# EAGLE design slush_cap_board_rev_a (EAGLE 8.5.0)
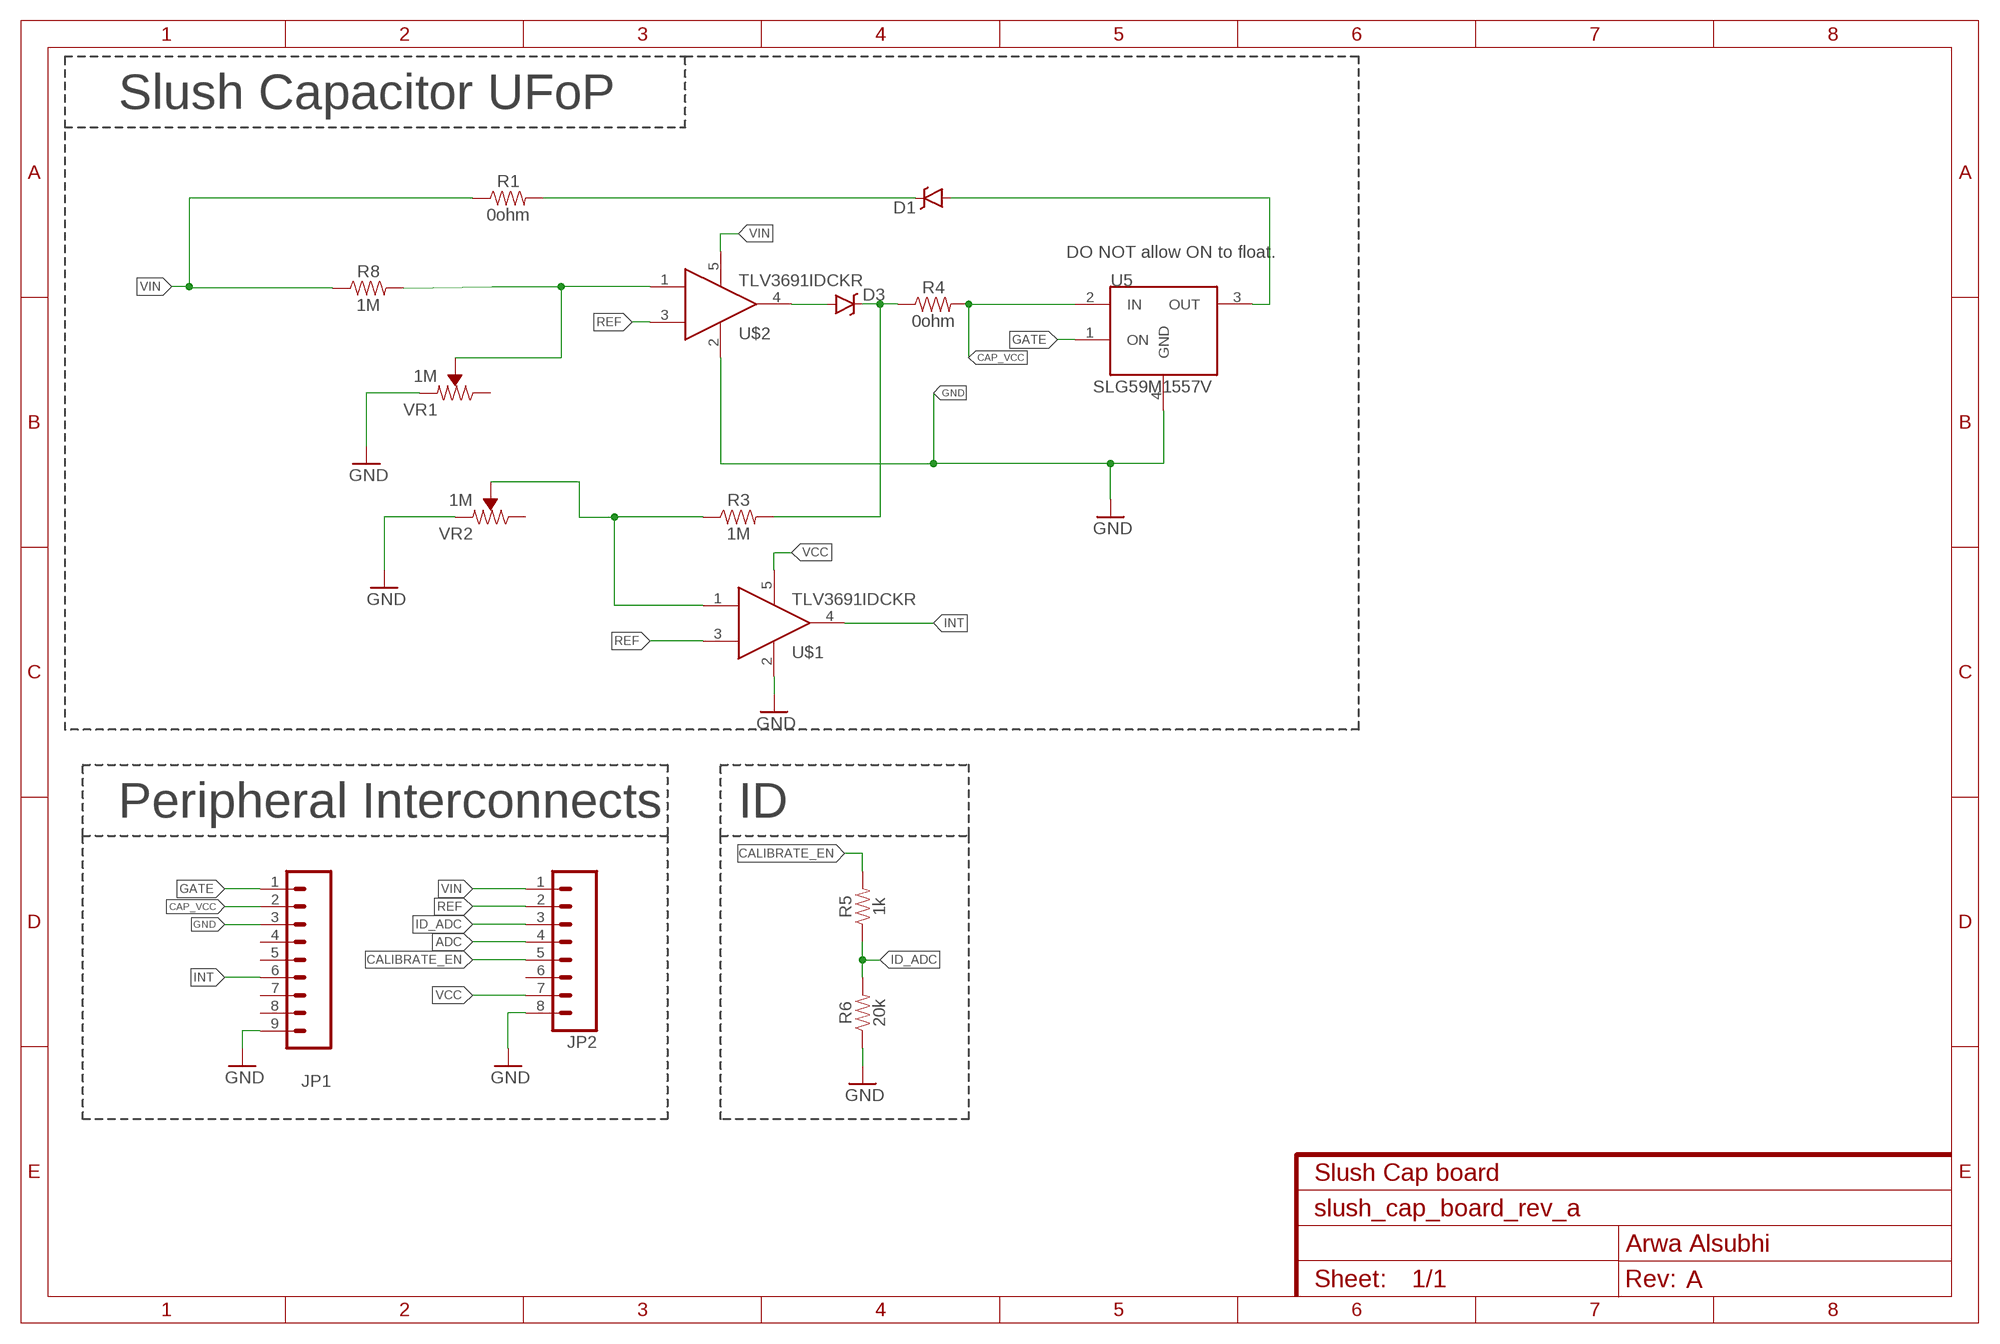
[diagram p0: schematic, sheet 1]
FRAME2 (FRAME-A4L): CNAME: Slush Cap board; CREVISION: A; DESIGNER: Arwa Alsubhi

## Parts
D1  RB751  DIODE-SCHOTTKY-RB751  [SOD-523]
D3  RB751  DIODE-SCHOTTKY-RB751  [SOD-523]
JP1  M091.27MM  [1X09-1.27MM]
JP2  M081.27MM  [1X08-1.27MM]
R1  0ohm  0603-RESISTOR-0603-1/10W-1%  [0603]
R3  1M  0.3OHM-0805-1/8W-1%  [0805]
R4  0ohm  0603-RESISTOR-0603-1/10W-1%  [0603]
R5  1k  0603-RESISTOR-0603-1/10W-1%  [0603]
R6  20k  0603-RESISTOR-0603-1/10W-1%  [0603]
R8  1M  0.3OHM-0805-1/8W-1%  [0805]
U5  SLG59M1557V  [4STDFN]
U$1  TLV3691IDCKR  [SOT353]
U$2  TLV3691IDCKR  [SOT353]
VR1  1M  TRIMPOT-SMD-3MM-CLOSED-1/8W-20%  [TRIMPOT-SMD-3MM-CLOSED]
VR2  1M  TRIMPOT-SMD-3MM-CLOSED-1/8W-20%  [TRIMPOT-SMD-3MM-CLOSED]

## Nets
ADC: JP2.4
CALIBRATE_EN: JP2.5 R5.2
CAP_VCC: JP1.2 R4.2 U5.2(IN)
GATE: JP1.1 U5.1(ON)
GND: JP1.3 JP1.9 JP2.8 R6.1 U5.4(GND) U$1.2 U$2.2 VR1.1(CCW) VR2.1(CCW)
ID_ADC: JP2.3 R5.1 R6.2
INT: JP1.6 U$1.4
N$1: D3.A U$2.4
N$2: D3.C R3.2 R4.1
N$3: D1.A U5.3(OUT)
N$4: R8.2 U$2.1 VR1.2(WIPER)
N$5: R3.1 U$1.1 VR2.2(WIPER)
N$6: D1.C R1.2
REF: JP2.2 U$1.3 U$2.3
VCC: JP2.7 U$1.5
VIN: JP2.1 R1.1 R8.1 U$2.5
Unconnected: JP1.4 JP1.5 JP1.7 JP1.8 JP2.6 VR1.3(CW) VR2.3(CW)

## Notes on the sheet
- Slush Capacitor UFoP
- DO NOT allow ON to float.
- Peripheral Interconnects | ID

## Library data of the parts
D1 D3 = SparkFun-DiscreteSemi:DIODE-SCHOTTKY: Schottky diodes in SFE's production catalog BAT20J 1A 23V 0.62Vf RB751 120mA 40V 0.37Vf PMEG4005EJ 0.5A 40V 0.42Vf MBRA140 1A 40V 0.5Vf B340A 3A 40V SMA; DIGIKEY: BAS40-02V-V-G-08GICT-ND; MPN: BAS40-02V-V-G-08; PROD_ID: DIO-11018
JP1 = SparkFun-Connectors:M09: Header 9 Standard 9-pin 0.1" header. Use with straight break away headers (SKU : PRT-00116), right angle break away headers (PRT-00553), swiss pins (PRT-00743), machine pins (PRT-00117), and female headers (PRT-00115).; DIGIKEY: S9014E-09-ND; MANUFACTURERPARTNUMBER: GRPB091VWVN-RC; MPN: GRPB091VWVN-RC
JP2 = SparkFun-Connectors:M08: Header 8 Standard 8-pin 0.1" header. Use with straight break away headers (SKU : PRT-00116), right angle break away headers (PRT-00553), swiss pins (PRT-00743), machine pins (PRT-00117), and female headers (PRT-00115).; DIGIKEY: S9014E-08-ND; MANUFACTURERPARTNUMBER: GRPB081VWVN-RC; MPN: GRPB081VWVN-RC
R1 R4-R6 = Arwa_lib:0603-RESISTOR: resistor A resistor is a passive two-terminal electrical component that implements electrical resistance as a circuit element. Resistors act to reduce current flow, and, at the same time, act to lower voltage levels within circuits. - Wikipedia; PROD_ID: RES-08787
R3 R8 = SparkFun-Resistors:0.3OHM: 0.3Ω resistor A resistor is a passive two-terminal electrical component that implements electrical resistance as a circuit element. Resistors act to reduce current flow, and, at the same time, act to lower voltage levels within circuits. - Wikipedia; PROD_ID: RES-11622; VALUE: 0.3
U5 = loadswitches:SLG59M1557V: SILEGO SLG59M1557V: Ultra-small 28.5 mΩ, 1.0 A Integrated Power Switch with Discharge The SLG59M1557V is designed for load switching applications with ultra low quiescent current (20nA), and low turn on voltage (0.85V). The part comes with one 28.5 mΩ 1.0 A rated P-channel MOSFET controlled by a single ON control pin. The product is packaged in an ultra-small 1.0 x 1.0 mm package.; MANAFACTURER: SLG59M1557V; MOUSER: 402-SLG59M1557V; MPN: SLG59M1557V
U$1 U$2 = Arwa_lib:TLV3691IDCKR
VR1 VR2 = SparkFun-Resistors:TRIMPOT: Trimming Potentiometer (Trimpot) Three-terminal potentiometers, with an adjustable wiper and two adjustable resistors. A pot can be used to create a configurable voltage divider, or as a variable resistor. "Trimpots" are a subset of potentiometers, usually intended for "set-and-forget" applications. They're often more delicate than standard potentiometers - rated for fewer turns. Variants PTH-KNOB - PTH Trimpot w/ finger-adjustable knob Trimpot 10K with Knob <https://www.sparkfun.com/products/9806> (COM-09806) Datasheet <http://www.sparkfun.com/datasheets/Components/General/TSR-3386.pdf> SMD-3MM-CLOSED-FRAME - SMD 3mm Square Closed-Frame Trimpot Used on e.g. EasyDriver - Stepper Motor Driver <https://www.sparkfun.com/products/12779> Datasheet <http://www.bitechnologies.com/pdfs/22.pdf> (22AR10KTR) SMD-5MM - SMD 5mm Square Closed-Frame Trimpot Used on e.g. IOIO-OTG - V2.2 <https://www.sparkfun.com/products/13613> Datasheet <http://www.vishay.com/docs/51008/ts53.pdf> (TS53YL502MR10) SMD-3MM-1/10W-25% - 3mm Square Open-Frame Trimpot Used on e.g. SparkFun Shapeoko <https://www.sparkfun.com/products/13899> Datasheet <http://www.bourns.com/docs/Product-Datasheets/TC33.pdf> (TC33X-2-103E); PROD_ID: RES-09285; VALUE: 10k

## Board
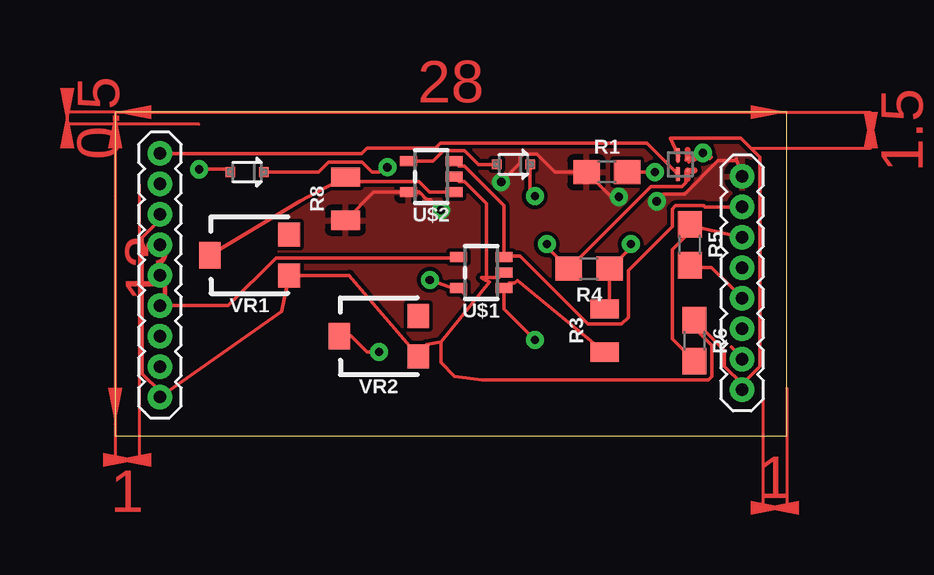
[diagram p1: board, top side]
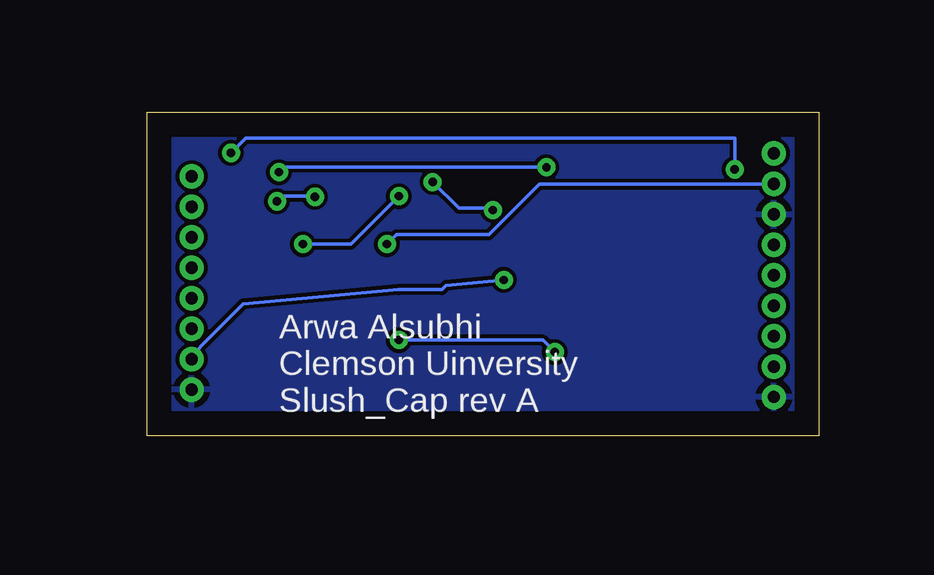
[diagram p2: board, bottom side, seen from below]

Size 28 x 13.5 mm. Coordinates in mm from the lower left corner, seen from the top.
Outline: 0,0 28,0 28,13.5 0,13.5 0,0
Copper layers (1*16): Top 0.035mm / dielectric 1.5mm / Bottom 0.035mm
Design rules "default": minimum track width 6mil, minimum drill 0.35mm, track to track 6mil, track to pad 6mil, pad to pad 6mil, via to via 6mil, smd to smd 6mil, copper to edge 40mil, drill to drill 6mil, minimum pad ring 10mil, minimum via ring 8mil, stop-mask expansion 4mil, vias tented up to drill 0mil, thermal gap 10mil

### Footprints (pad centres in the part's own frame; a part is rotated, then mirrored left to right if it is on the bottom)
SOD-523 = smd 0.4 x 0.4: A -0.7,0; C 0.7,0
1X09-1.27MM = drill 0.508 pad 1: 1 0,0; 2 1.27,0; 3 2.54,0; 4 3.81,0; 5 5.08,0; 6 6.35,0; 7 7.62,0; 8 8.89,0; 9 10.16,0
1X08-1.27MM = drill 0.508 pad 1: 1 0,0; 2 1.27,0; 3 2.54,0; 4 3.81,0; 5 5.08,0; 6 6.35,0; 7 7.62,0; 8 8.89,0
0603 = smd 1.1 x 1: 1 -0.85,0; 2 0.85,0
0805 = smd 0.8 x 1.2: 1 -0.9,0; 2 0.9,0
4STDFN = smd 0.6 x 0.2: 1 -0.4,0.1; 4 0.4,0.1 | smd 0.152 x 0.152: 2 -0.25,-0.3; 3 0.25,-0.3
SOT353 = smd 0.42 x 0.7: 1 -0.65,-0.95; 2 0,-0.95; 3 0.65,-0.95; 4 0.65,0.95; 5 -0.65,0.95
TRIMPOT-SMD-3MM-CLOSED = smd 1 x 0.9: 1 -0.85,-1.65; 3 0.85,-1.65 | smd 1.1 x 0.9: 2 0,1.65

### Placement (x,y rotation side)
D1  5.5,11 0 top
D3  16.6,11.32 0 top
JP1  1.87,11.78 270 top
JP2  26.14,10.82 270 top
R1  20.5,11 0 top
R3  20.41,4.39 90 top
R4  19.76,6.97 180 top
R5  23.95,7.97 270 top
R6  24.14,3.97 270 top
R8  9.6,9.89 90 top
U5  23.56,11.32 90 top
U$1  15.26,6.81 90 top
U$2  13.18,10.81 90 top
VR1  5.6,7.54 90 top
VR2  10.99,4.16 90 top

### Tracks (layer width: path | path; a pad name or v marks a point on that pad's centre or on a via)
CALIBRATE_EN
  Top 0.152: R5.2 23.99,7.03 24.86,7.03 25.62,6.26 JP2.5
CAP_VCC  (via drill 0.35)
  Top 0.152: U5.2 23.79,11 23.79,10.56 23.62,10.39 22.33,10.39 R4.2 18,7.88 v18,8
  Bottom 0.152: v18,8 17.61,8.39 13.75,8.39 11.63,10.51 JP1.2
GATE
  Top 0.152: 23.38,10.99 U5.1 22.18,12.2 13.56,12.2 13.36,12 10.5,12 10.28,11.78 JP1.1
GND
  Top 0.152: U$1.2 16,6.6 15.27,6.6 15.49,6.48 | 13.58,3.92 12.98,3.81 VR2.1 9.76,6.69 VR1.1 6.94,5.19 JP1.9 1.87,1.85 1.13,2.58 1.13,8.28 1.87,9.01 JP1.3 | 13.58,3.92 15.61,6.41 15.49,6.48 | 26.14,2.16 25.4,2.9 25.4,3.56 R6.1 24.14,4.49 24.87,3.77 24.87,2.48 24.73,2.34 15.3,2.34 14.16,2.49 13.58,3.06 13.58,3.92 | U5.4 23.5,11.68 | 23.46,11.45 U5.4 | 26.14,2.16 JP2.8 | 26.14,2.16 26.88,2.9 26.88,11.62 26.09,12.41 23.15,12.41 U5.4 | U$2.2 14.34,10.6 14.57,10.6 15.49,9.69 15.49,6.48
  pour Bottom: 0,14 28,14 28,0 0,0
ID_ADC
  Top 0.152: R6.2 23.22,4.04 23.22,7.76 23.95,8.49 R5.1 23.99,8.78 JP2.3
INT
  Top 0.152: JP1.6 4.72,5.43 6.71,7.42 14.27,7.42 U$1.4
N$1
  Top 0.152: D3.A 15.15,11.32 14.57,11.9 13.69,11.9 13.25,11.46 U$2.4
N$2  (via drill 0.35)
  Top 0.152: R3.2 20.61,5.49 R4.1 21.5,7.86 v21.5,8 | v17.5,10 17.3,10.2 D3.C
  Bottom 0.152: v21.5,8 19.5,8 v17.5,10
N$3  (via drill 0.35)
  Top 0.152: U5.3 23.91,11.52 23.91,11.43 | 23.79,11.5 U5.3 | U5.3 24.8,11.57 24.87,11.63 24.7,11.8 v24.5,11.8 | v3.5,11.12 4.68,11.12 D1.A
  Bottom 0.152: v24.5,11.8 23.89,12.41 3.5,12.41 v3.5,11.12
N$4
  Top 0.152: U$2.1 13.11,10.16 12.68,10.6 9.79,10.6 R8.2 7.7,9.79 VR1.2
N$5  (via drill 0.35)
  Top 0.152: R3.1 16.77,6.49 16.66,6.37 16.42,6.37 U$1.1 16.21,5.29 v17.5,4 | VR2.2 9.84,4.16 10.5,3.5 v11,3.5
  Bottom 0.152: v11,3.5 11.5,4 v17.5,4
N$6  (via drill 0.35)
  Top 0.152: D1.C 8.49,11 8.9,11.42 10.29,11.42 10.71,11 11,11 11.21,11.21 v11.35,11.21 | v22.5,11 R1.2
  Bottom 0.152: v11.35,11.21 22.3,11.21 v22.5,11
REF
  Top 0.152: U$2.3 14.34,11.25 14.57,11.25 16.21,9.61 16.21,7.5 | 16.21,7.5 U$1.3 | JP2.2 24.59,9.55 24.55,9.6 23.36,9.6 23.22,9.46 23.22,8.72 21.39,6.89 21.39,4.95 21.11,4.66 19.71,4.66 16.88,7.5 16.21,7.5
VCC  (via drill 0.35)
  Top 0.152: 14.5,6.24 14.58,6.16 U$1.5 | 14.45,6.29 14.5,6.24 | U$1.5 14.6,5.87 14.6,6.02 14.5,6.12 14.5,6.24 | JP2.7 25.69,3.7 | v13.12,6.5 14.23,6.11 U$1.5
  Bottom 0.152: v13.12,6.5 15.53,6.28 15.71,6.1 17.51,6.1 23.99,5.5 25.66,3.83 26.12,3.33 JP2.7
VIN  (via drill 0.35)
  Top 0.152: R8.1 10.77,10.16 U$2.5 12.68,10.16 12.99,9.86 13.14,9.86 v13.58,9.42 | JP2.1 25.92,11.47 | 25.92,11.47 25.89,11.57 | v22.58,9.79 22.89,10.09 23.75,10.09 25.14,11.47 25.92,11.47 | v21,9.97 20.68,9.97 R1.1 18.34,11 17.59,11.75 17,11.75 16.87,11.62 16.87,11.37 v16.09,10.59
  Bottom 0.152: v22.58,9.79 22.37,10 21,10 v21,9.97 | v16.09,10.59 15,9.5 13.5,9.5 v13.58,9.42
  pour Top: 0,14 28,14 28,-0.5 0,-0.5
(copper drawn outside any net)
  shapes: Top area x6

### Text on the board
bNames: Arwa Alsubhi / Clemson Uinversity / Slush_Cap rev A